# EAGLE design proto (EAGLE 6.6.0)
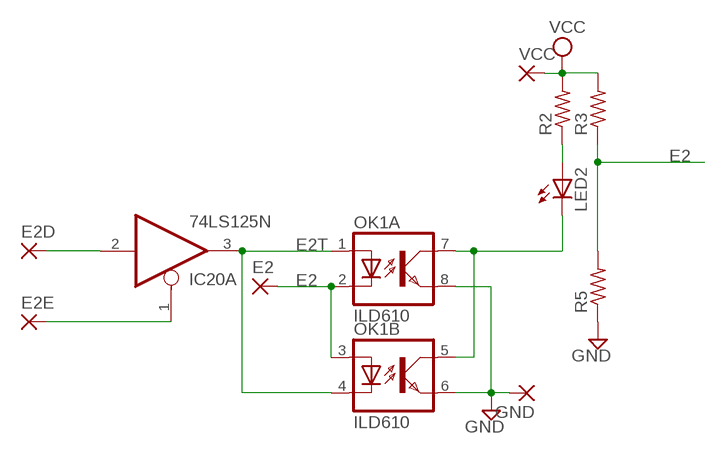
[diagram p0: schematic, sheet 1]

## Parts
E2  1,6/0,9  [1,6/0,9]
E2D  1,6/0,9  [1,6/0,9]
E2E  1,6/0,9  [1,6/0,9]
GND  1,6/0,9  [1,6/0,9]
IC20  74LS125N  [DIL14]
LED2  LED5MM  [LED5MM]
OK1  ILD610  [DIL08]
R2  R-US_0207/10  [0207/10]
R3  R-US_0207/10  [0207/10]
R5  R-US_0207/10  [0207/10]
VCC  1,6/0,9  [1,6/0,9]

## Nets
E2: E2.1(P) OK1.2(A:C) OK1.3(B:A) R3.1 R5.2
E2T: IC20.3(A:O) OK1.1(A:A) OK1.4(B:C)
GND [Power]: GND.1(P) OK1.6(B:EMIT) OK1.8(A:EMIT) R5.1
N$1: LED2.K(C) OK1.5(B:COL) OK1.7(A:COL)
N$4: LED2.A R2.1
N$59: E2D.1(P) IC20.2(A:I)
N$60: E2E.1(P) IC20.1(A:OE)
VCC [Power]: R2.2 R3.2 VCC.1(P)
Unconnected: IC20.4(B:OE) IC20.5(B:I) IC20.6(B:O) IC20.8(C:O) IC20.9(C:I) IC20.10(C:OE) IC20.11(D:O) IC20.12(D:I) IC20.13(D:OE)

## Power pins joined to a net without a drawn wire
GND: IC20.7(P:GND)
VCC: IC20.14(P:VCC)

## Library data of the parts
E2 E2D E2E GND VCC = wirepad:1,6/0,9: THROUGH-HOLE PAD
IC20 = 74xx-us:74*125: Quad bus BUFFER, 3-state
LED2 = led:LED: LED OSRAM: - CHIPLED LG R971, LG N971, LY N971, LG Q971, LY Q971, LO R971, LY R971 LH N974, LH R974 LS Q976, LO Q976, LY Q976 LO Q996 - Hyper CHIPLED LW Q18S LB Q993, LB Q99A, LB R99A - SideLED LS A670, LO A670, LY A670, LG A670, LP A670 LB A673, LV A673, LT A673, LW A673 LH A674 LY A675 LS A676, LA A676, LO A676, LY A676, LW A676 LS A679, LY A679, LG A679 - Hyper Micro SIDELED® LS Y876, LA Y876, LO Y876, LY Y876 LT Y87S - SmartLED LW L88C, LW L88S LB L89C, LB L89S, LG L890 LS L89K, LO L89K, LY L89K LS L896, LA L896, LO L896, LY L896 - TOPLED LS T670, LO T670, LY T670, LG T670, LP T670 LSG T670, LSP T670, LSY T670, LOP T670, LYG T670 LG T671, LOG T671, LSG T671 LB T673, LV T673, LT T673, LW T673 LH T674 LS T676, LA T676, LO T676, LY T676, LB T676, LH T676, LSB T676, LW T676 LB T67C, LV T67C, LT T67C, LS T67K, LO T67K, LY T67K, LW E67C LS E67B, LA E67B, LO E67B, LY E67B, LB E67C, LV E67C, LT E67C LW T67C LS T679, LY T679, LG T679 LS T770, LO T770, LY T770, LG T770, LP T770 LB T773, LV T773, LT T773, LW T773 LH T774 LS E675, LA E675, LY E675, LS T675 LS T776, LA T776, LO T776, LY T776, LB T776 LHGB T686 LT T68C, LB T68C - Hyper Mini TOPLED® LB M676 - Mini TOPLED Santana® LG M470 LS M47K, LO M47K, LY M47K Source: http://www.osram.convergy.de LUXEON: - LUMILED® LXK2-PW12-R00, LXK2-PW12-S00, LXK2-PW14-U00, LXK2-PW14-V00 LXK2-PM12-R00, LXK2-PM12-S00, LXK2-PM14-U00 LXK2-PE12-Q00, LXK2-PE12-R00, LXK2-PE12-S00, LXK2-PE14-T00, LXK2-PE14-U00 LXK2-PB12-K00, LXK2-PB12-L00, LXK2-PB12-M00, LXK2-PB14-N00, LXK2-PB14-P00, LXK2-PB14-Q00 LXK2-PR12-L00, LXK2-PR12-M00, LXK2-PR14-Q00, LXK2-PR14-R00 LXK2-PD12-Q00, LXK2-PD12-R00, LXK2-PD12-S00 LXK2-PH12-R00, LXK2-PH12-S00 LXK2-PL12-P00, LXK2-PL12-Q00, LXK2-PL12-R00 Source: www.luxeon.com KINGBRIGHT: KA-3528ASYC Source: www.kingbright.com
OK1 = optocoupler:ILD610: SIEMENS OPTO COUPLER; MF: VISHAY/TELEFUNKEN; MPN: ILD610-4; OC_FARNELL: unknown; OC_NEWARK: 20H8702
R2 R3 R5 = rcl:R-US_: RESISTOR, American symbol

## Net classes
1 Power: width 0.508 mm, drill 0.254 mm, clearance 0.254 mm

## Board
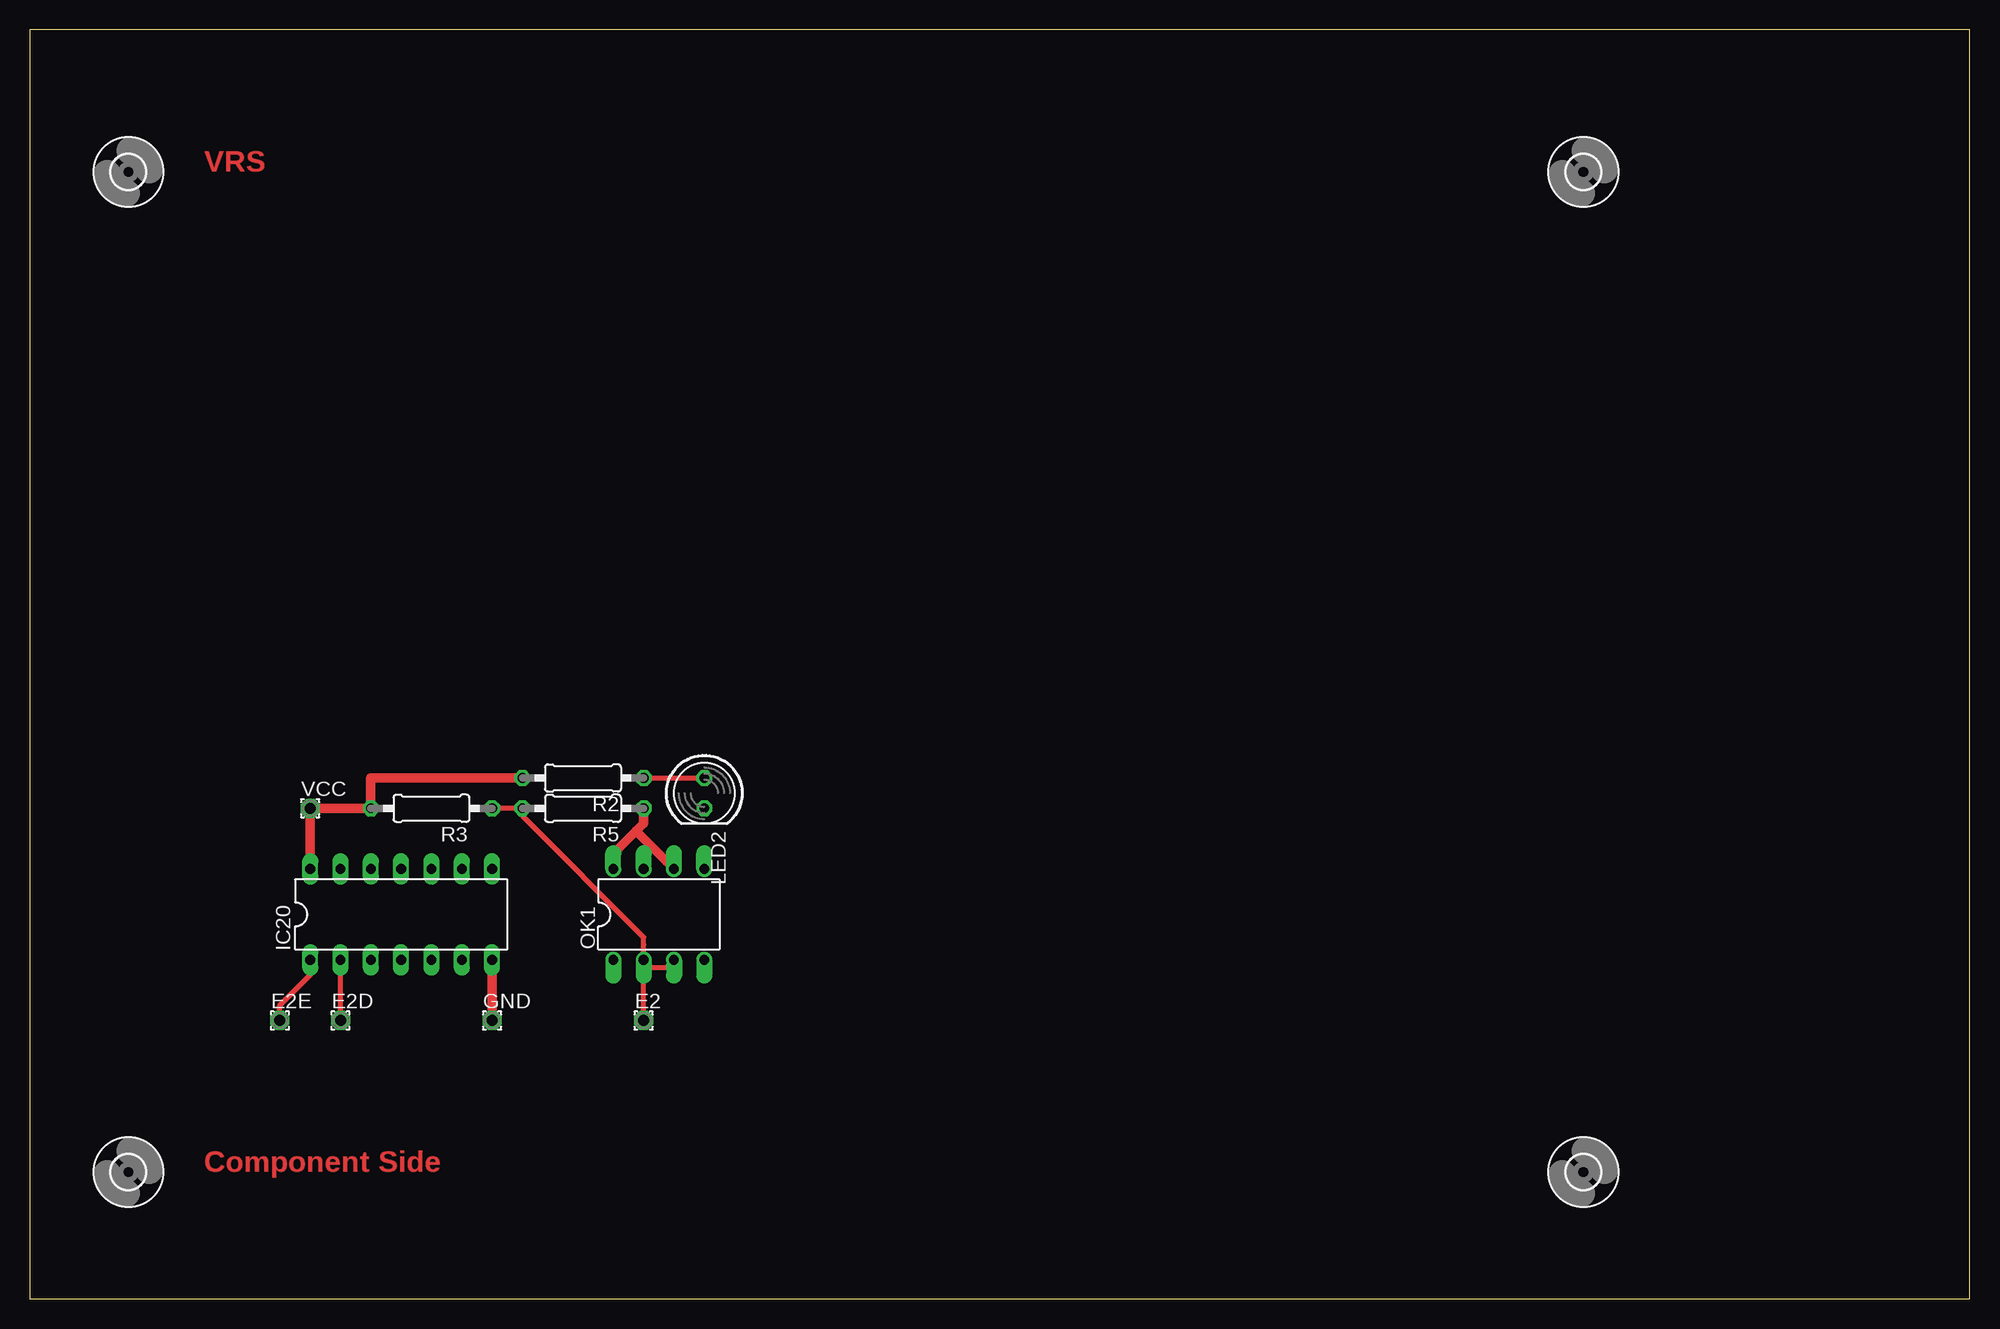
[diagram p1: board, top side]
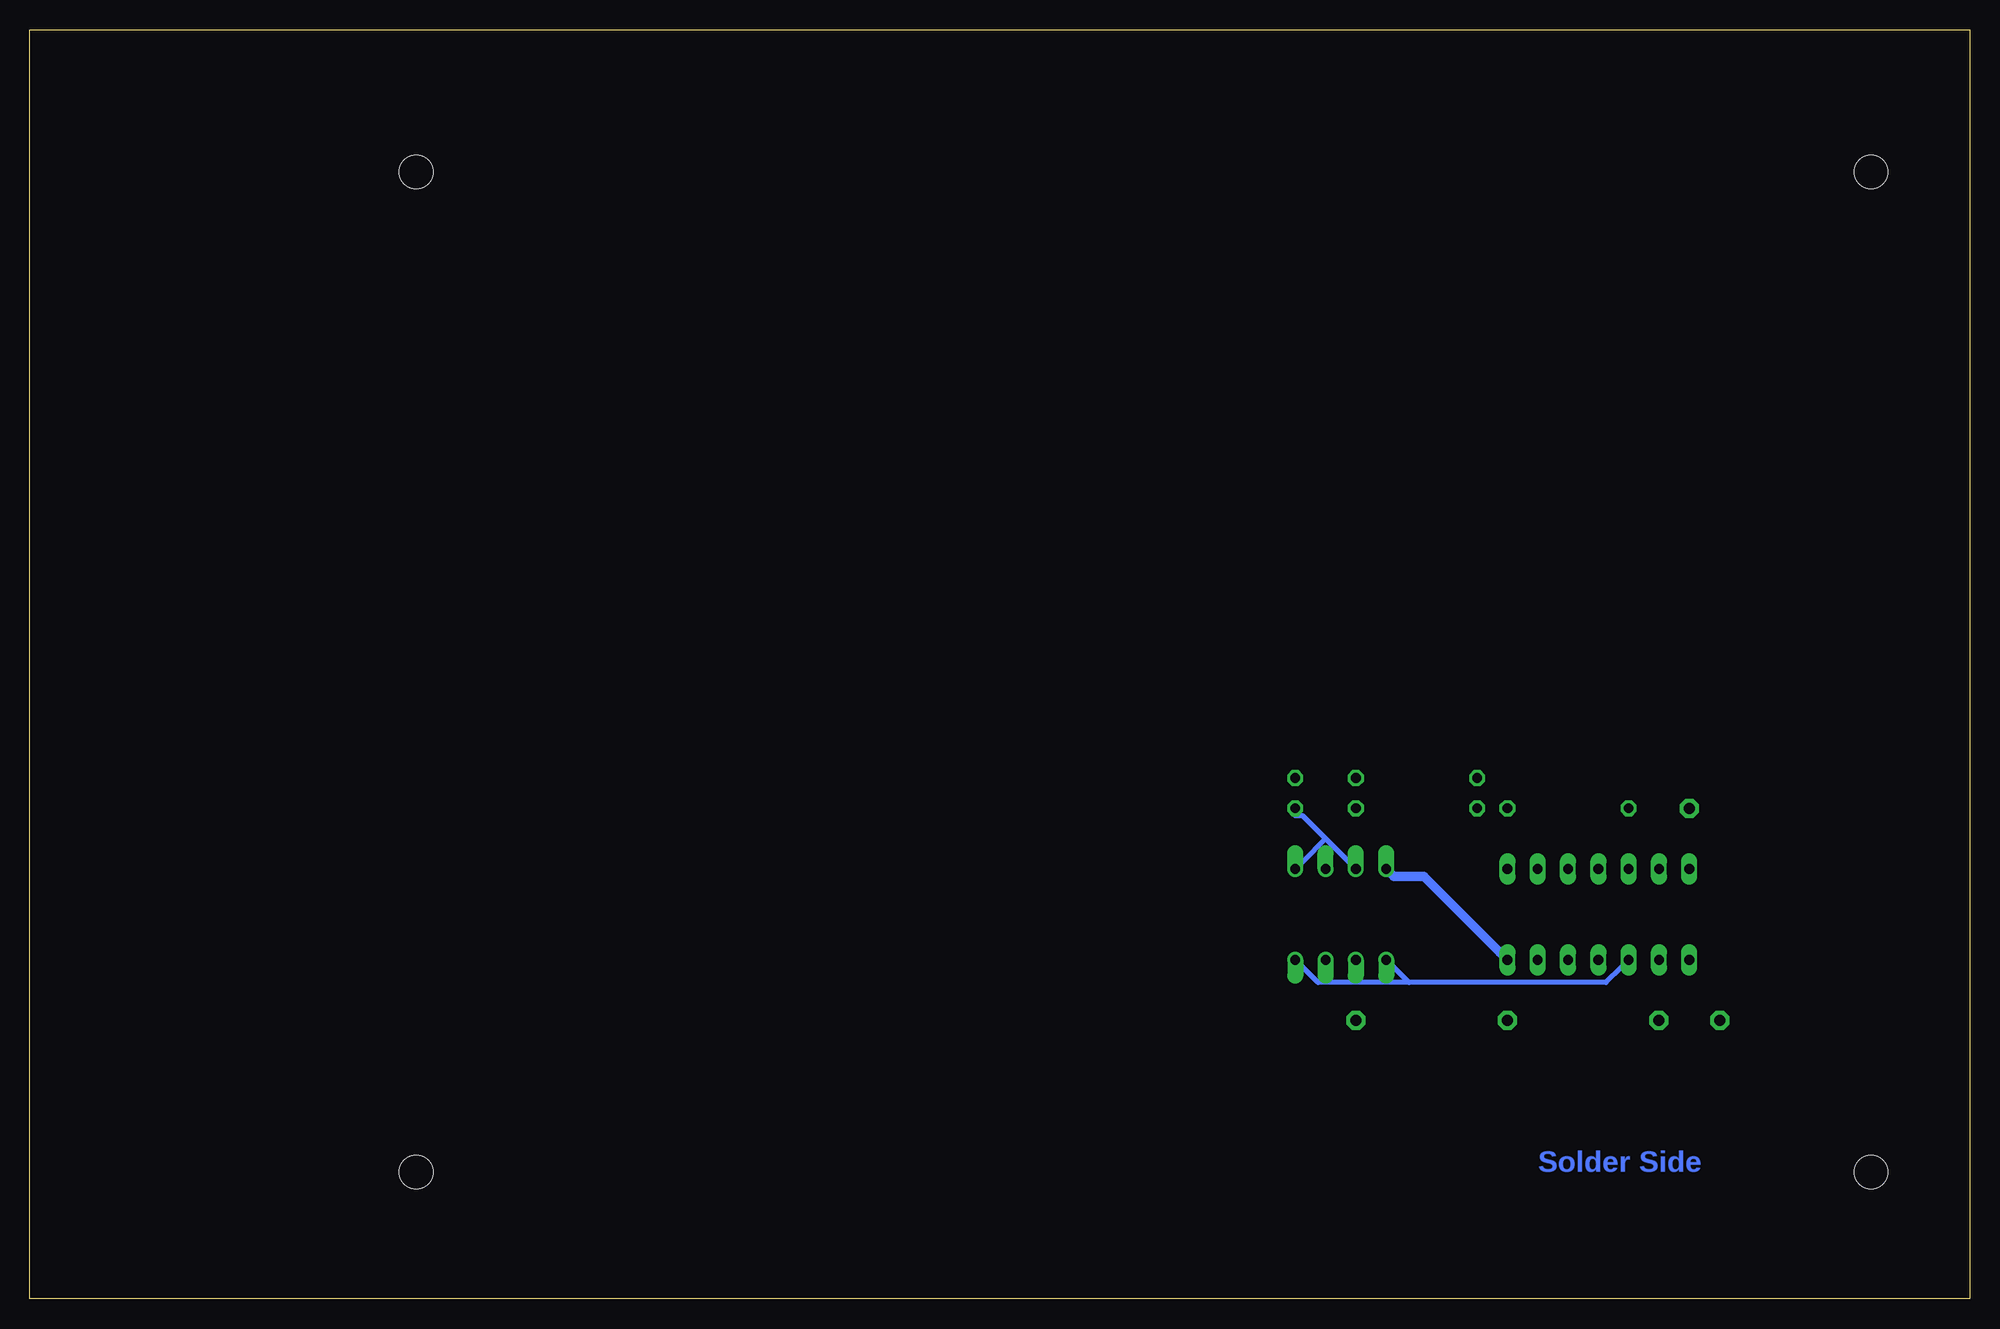
[diagram p2: board, bottom side, seen from below]

Size 162.54 x 106.35 mm. Coordinates in mm from the lower left corner, seen from the top.
Outline: 0,0 162.54,0 162.54,106.35 0,106.35 0,0
Copper layers (1+16): Top 0.035mm / dielectric 1.5mm / Bottom 0.035mm
Design rules "16mils": minimum track width 16mil, minimum drill 32mil, track to track 15mil, track to pad 10mil, pad to pad 10mil, via to via 10mil, smd to smd 10mil, copper to edge 13mil, drill to drill 10mil, minimum pad ring 10mil, minimum via ring 8mil, stop-mask expansion 0mil, vias tented up to drill 0mil, thermal gap 10mil

### Footprints (pad centres in the part's own frame; a part is rotated, then mirrored left to right if it is on the bottom)
1,6/0,9 = drill 0.914 pad 1.6 octagon: 1 0,0
DIL14 = drill 0.813 long: 1 -7.62,-3.81; 2 -5.08,-3.81; 3 -2.54,-3.81; 4 0,-3.81; 5 2.54,-3.81; 6 5.08,-3.81; 7 7.62,-3.81; 8 7.62,3.81; 9 5.08,3.81; 10 2.54,3.81; 11 0,3.81; 12 -2.54,3.81; 13 -5.08,3.81; 14 -7.62,3.81
LED5MM = drill 0.813 octagon: A -1.27,0; K 1.27,0
DIL08 = drill 0.813 offset: 1 -3.81,-3.81; 2 -1.27,-3.81; 3 1.27,-3.81; 4 3.81,-3.81; 5 3.81,3.81; 6 1.27,3.81; 7 -1.27,3.81; 8 -3.81,3.81
0207/10 = drill 0.813 octagon: 1 -5.08,0; 2 5.08,0
2,8 = hole 2.8: 0,0

### Placement (x,y rotation side)
E2  51.43,23.33 0 top
E2D  26.03,23.33 0 top
E2E  20.95,23.33 0 top
GND  38.73,23.33 0 top
IC20  31.11,32.22 0 top
LED2  56.51,42.38 270 top
OK1  52.7,32.22 0 top
R2  46.35,43.65 180 top
R3  33.65,41.11 180 top
R5  46.35,41.11 180 top
U$1  [2,8]  130.17,10.63 0 top
U$2  [2,8]  130.17,94.45 0 top
U$3  [2,8]  8.25,94.45 0 top
U$4  [2,8]  8.25,10.63 0 top
VCC  23.49,41.11 0 top

### Tracks (layer width: path | path; a pad name or v marks a point on that pad's centre or on a via)
E2
  Top 0.406: R3.1 39.37,41.11 40.63,41.11 R5.2 41.27,40.47 51.43,30.32 51.43,29.68 OK1.2 | OK1.2 52.06,27.77 53.34,27.77 OK1.3 | E2.1 51.43,23.96 51.43,27.14 OK1.2
E2T
  Bottom 0.406: 46.98,26.5 30.48,26.5 29.21,27.77 IC20.3 | 46.98,26.5 48.26,27.77 OK1.1 | 46.98,26.5 54.61,26.5 55.88,27.77 OK1.4
GND
  Top 0.813: IC20.7 38.73,27.14 38.73,23.96 GND.1 | 50.8,39.2 51.43,39.84 51.43,40.47 R5.1 | 50.8,39.2 48.89,37.3 OK1.8 | 50.8,39.2 53.34,36.66 OK1.6
  Bottom 0.813: IC20.7 39.37,29.04 45.72,35.39 48.26,35.39 OK1.8
N$1
  Bottom 0.406: 53.97,38.57 55.88,40.47 56.51,40.47 LED2.K | 53.97,38.57 52.06,36.66 OK1.7 | 53.97,38.57 55.88,36.66 OK1.5
N$4
  Top 0.406: R2.1 52.06,43.65 55.88,43.65 LED2.A
N$59
  Top 0.406: IC20.2 26.03,27.14 26.03,23.96 E2D.1
N$60
  Top 0.406: IC20.1 23.49,27.14 20.95,24.6 20.95,23.96 E2E.1
VCC
  Top 0.813: IC20.14 23.49,37.3 23.49,40.47 VCC.1 24.12,41.11 27.94,41.11 R3.2 28.57,41.75 28.57,43.65 40.63,43.65 R2.2

### Text on the board
Top: VRS | Component Side
Bottom: Solder Side
tValues: FlipChip Interface- Rev. 1